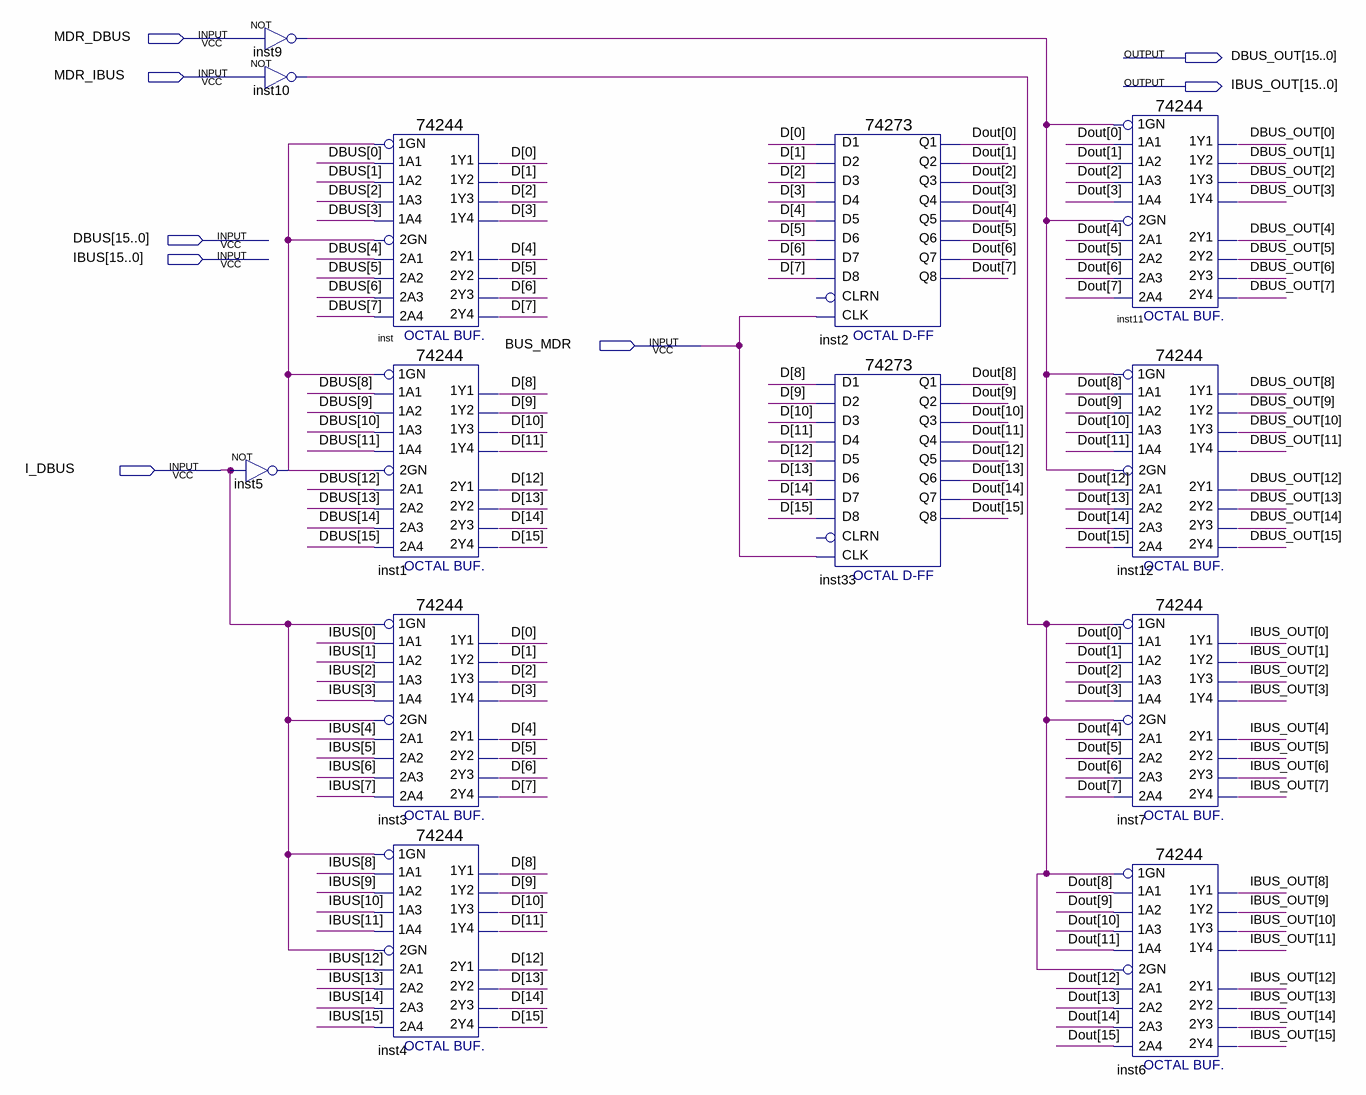
[diagram p0: schematic sheet]
// Quartus schematic MDR_MUX.bdf as structural Verilog: 13 symbols, 8 pins
module MDR_MUX (
  input  MDR_DBUS,
  input  MDR_IBUS,
  input  [15:0] DBUS,
  input  [15:0] IBUS,
  input  BUS_MDR,
  input  I_DBUS,
  output [15:0] DBUS_OUT,
  output [15:0] IBUS_OUT
);

  wire inst5_out, inst9_out, inst10_out;
  wire [15:0] D, Dout;

  not inst9 (inst9_out, MDR_DBUS);
  not inst10 (inst10_out, MDR_IBUS);
  not inst5 (inst5_out, I_DBUS);
  \74244  inst (
    .\1A2 (DBUS[1]), .\1A4 (DBUS[3]), .\1A1 (DBUS[0]), .\1A3 (DBUS[2]), .\1GN (inst5_out), .\2A3 (DBUS[6]),
    .\2GN (inst5_out), .\2A1 (DBUS[4]), .\2A4 (DBUS[7]), .\2A2 (DBUS[5]), .\1Y2 (D[1]), .\1Y4 (D[3]),
    .\2Y1 (D[4]), .\1Y1 (D[0]), .\2Y3 (D[6]), .\2Y4 (D[7]), .\1Y3 (D[2]), .\2Y2 (D[5]));
  \74244  inst1 (
    .\1A2 (DBUS[9]), .\1A4 (DBUS[11]), .\1A1 (DBUS[8]), .\1A3 (DBUS[10]), .\1GN (inst5_out),
    .\2A3 (DBUS[14]), .\2GN (inst5_out), .\2A1 (DBUS[12]), .\2A4 (DBUS[15]), .\2A2 (DBUS[13]), .\1Y2 (D[9]),
    .\1Y4 (D[11]), .\2Y1 (D[12]), .\1Y1 (D[8]), .\2Y3 (D[14]), .\2Y4 (D[15]), .\1Y3 (D[10]), .\2Y2 (D[13]));
  \74244  inst3 (
    .\1A2 (IBUS[1]), .\1A4 (IBUS[3]), .\1A1 (IBUS[0]), .\1A3 (IBUS[2]), .\1GN (I_DBUS), .\2A3 (IBUS[6]),
    .\2GN (I_DBUS), .\2A1 (IBUS[4]), .\2A4 (IBUS[7]), .\2A2 (IBUS[5]), .\1Y2 (D[1]), .\1Y4 (D[3]),
    .\2Y1 (D[4]), .\1Y1 (D[0]), .\2Y3 (D[6]), .\2Y4 (D[7]), .\1Y3 (D[2]), .\2Y2 (D[5]));
  \74244  inst4 (
    .\1A2 (IBUS[9]), .\1A4 (IBUS[11]), .\1A1 (IBUS[8]), .\1A3 (IBUS[10]), .\1GN (I_DBUS), .\2A3 (IBUS[14]),
    .\2GN (I_DBUS), .\2A1 (IBUS[12]), .\2A4 (IBUS[15]), .\2A2 (IBUS[13]), .\1Y2 (D[9]), .\1Y4 (D[11]),
    .\2Y1 (D[12]), .\1Y1 (D[8]), .\2Y3 (D[14]), .\2Y4 (D[15]), .\1Y3 (D[10]), .\2Y2 (D[13]));
  \74273  inst2 (
    .D2(D[1]), .D3(D[2]), .D1(D[0]), .D4(D[3]), .D7(D[6]), .D6(D[5]), .D5(D[4]), .D8(D[7]), .CLK(BUS_MDR),
    .Q4(Dout[3]), .Q1(Dout[0]), .Q2(Dout[1]), .Q3(Dout[2]), .Q6(Dout[5]), .Q5(Dout[4]), .Q7(Dout[6]),
    .Q8(Dout[7]));  // open: CLRN
  \74273  inst33 (
    .D2(D[9]), .D3(D[10]), .D1(D[8]), .D4(D[11]), .D7(D[14]), .D6(D[13]), .D5(D[12]), .D8(D[15]),
    .CLK(BUS_MDR), .Q4(Dout[11]), .Q1(Dout[8]), .Q2(Dout[9]), .Q3(Dout[10]), .Q6(Dout[13]), .Q5(Dout[12]),
    .Q7(Dout[14]), .Q8(Dout[15]));  // open: CLRN
  \74244  inst11 (
    .\1A2 (Dout[1]), .\1A4 (Dout[3]), .\1A1 (Dout[0]), .\1A3 (Dout[2]), .\1GN (inst9_out), .\2A3 (Dout[6]),
    .\2GN (inst9_out), .\2A1 (Dout[4]), .\2A4 (Dout[7]), .\2A2 (Dout[5]), .\1Y2 (DBUS_OUT[1]),
    .\1Y4 (DBUS_OUT[3]), .\2Y1 (DBUS_OUT[4]), .\1Y1 (DBUS_OUT[0]), .\2Y3 (DBUS_OUT[6]), .\2Y4 (DBUS_OUT[7]),
    .\1Y3 (DBUS_OUT[2]), .\2Y2 (DBUS_OUT[5]));
  \74244  inst12 (
    .\1A2 (Dout[9]), .\1A4 (Dout[11]), .\1A1 (Dout[8]), .\1A3 (Dout[10]), .\1GN (inst9_out),
    .\2A3 (Dout[14]), .\2GN (inst9_out), .\2A1 (Dout[12]), .\2A4 (Dout[15]), .\2A2 (Dout[13]),
    .\1Y2 (DBUS_OUT[9]), .\1Y4 (DBUS_OUT[11]), .\2Y1 (DBUS_OUT[12]), .\1Y1 (DBUS_OUT[8]),
    .\2Y3 (DBUS_OUT[14]), .\2Y4 (DBUS_OUT[15]), .\1Y3 (DBUS_OUT[10]), .\2Y2 (DBUS_OUT[13]));
  \74244  inst7 (
    .\1A2 (Dout[1]), .\1A4 (Dout[3]), .\1A1 (Dout[0]), .\1A3 (Dout[2]), .\1GN (inst10_out), .\2A3 (Dout[6]),
    .\2GN (inst10_out), .\2A1 (Dout[4]), .\2A4 (Dout[7]), .\2A2 (Dout[5]), .\1Y2 (IBUS_OUT[1]),
    .\1Y4 (IBUS_OUT[3]), .\2Y1 (IBUS_OUT[4]), .\1Y1 (IBUS_OUT[0]), .\2Y3 (IBUS_OUT[6]), .\2Y4 (IBUS_OUT[7]),
    .\1Y3 (IBUS_OUT[2]), .\2Y2 (IBUS_OUT[5]));
  \74244  inst6 (
    .\1A2 (Dout[9]), .\1A4 (Dout[11]), .\1A1 (Dout[8]), .\1A3 (Dout[10]), .\1GN (inst10_out),
    .\2A3 (Dout[14]), .\2GN (inst10_out), .\2A1 (Dout[12]), .\2A4 (Dout[15]), .\2A2 (Dout[13]),
    .\1Y2 (IBUS_OUT[9]), .\1Y4 (IBUS_OUT[11]), .\2Y1 (IBUS_OUT[12]), .\1Y1 (IBUS_OUT[8]),
    .\2Y3 (IBUS_OUT[14]), .\2Y4 (IBUS_OUT[15]), .\1Y3 (IBUS_OUT[10]), .\2Y2 (IBUS_OUT[13]));
endmodule
